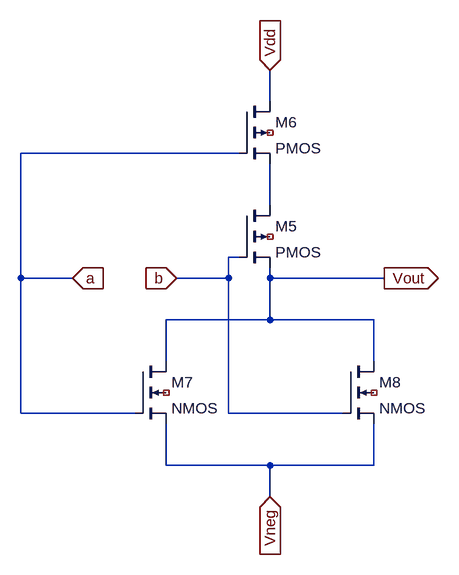
[diagram p0: schematic norsymb.asc]
norsymb.asc, the LTspice schematic file:
Version 4
SHEET 1 1772 784
WIRE 880 -16 880 -64
WIRE 832 64 496 64
WIRE 880 144 880 80
WIRE 832 224 816 224
WIRE 496 256 496 64
WIRE 576 256 496 256
WIRE 816 256 816 224
WIRE 816 256 736 256
WIRE 880 256 880 240
WIRE 1056 256 880 256
WIRE 880 320 880 256
WIRE 880 320 720 320
WIRE 1040 320 880 320
WIRE 720 384 720 320
WIRE 1040 384 1040 320
WIRE 496 464 496 256
WIRE 672 464 496 464
WIRE 816 464 816 256
WIRE 992 464 816 464
WIRE 720 544 720 480
WIRE 880 544 720 544
WIRE 1040 544 1040 480
WIRE 1040 544 880 544
WIRE 880 592 880 544
FLAG 880 -64 Vdd
IOPIN 880 -64 In
FLAG 576 256 a
IOPIN 576 256 In
FLAG 736 256 b
IOPIN 736 256 In
FLAG 1056 256 Vout
IOPIN 1056 256 Out
FLAG 880 592 Vneg
IOPIN 880 592 In
SYMBOL pmos4 832 144 R0
SYMATTR InstName M5
SYMBOL pmos4 832 -16 R0
SYMATTR InstName M6
SYMBOL nmos4 672 384 R0
SYMATTR InstName M7
SYMBOL nmos4 992 384 R0
SYMATTR InstName M8

The netlist it stands for:
* norsymb.asc
M5 N001 b Vout NC_01 PMOS
M6 Vdd a N001 NC_02 PMOS
M7 Vout a Vneg NC_03 NMOS
M8 Vout b Vneg NC_04 NMOS
.model NMOS NMOS
.model PMOS PMOS
.lib standard.mos
.backanno
.end